# Altium schematic sheet [8] TSAL.SchDoc
size A4; DocumentNumber: 8; SheetNumber: 9; SheetTotal: 10
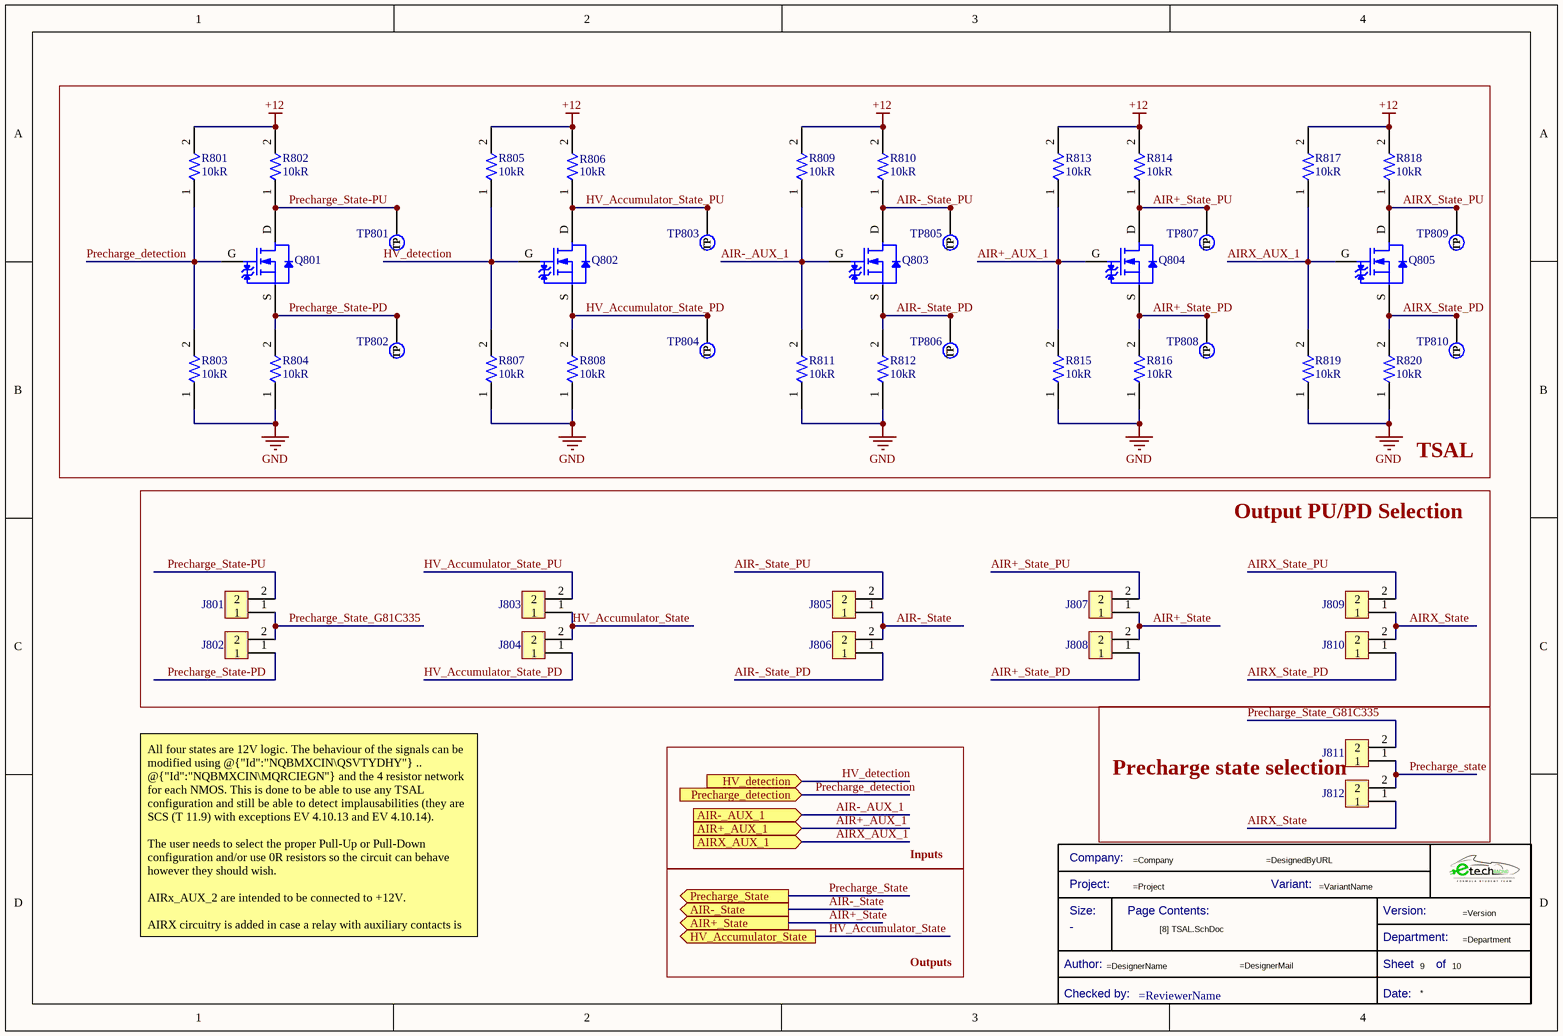
[diagram p0: [8] TSAL.SchDoc]

## Parts
*?  Title Block_template  (value not drawn)  (graphical)
J801  61300211121  [J_Pinheader_1x2]  (value not drawn)
J802  61300211121  [J_Pinheader_1x2]  (value not drawn)
J803  61300211121  [J_Pinheader_1x2]  (value not drawn)
J804  61300211121  [J_Pinheader_1x2]  (value not drawn)
J805  61300211121  [J_Pinheader_1x2]  (value not drawn)
J806  61300211121  [J_Pinheader_1x2]  (value not drawn)
J807  61300211121  [J_Pinheader_1x2]  (value not drawn)
J808  61300211121  [J_Pinheader_1x2]  (value not drawn)
J809  61300211121  [J_Pinheader_1x2]  (value not drawn)
J810  61300211121  [J_Pinheader_1x2]  (value not drawn)
J811  61300211121  [J_Pinheader_1x2]  (value not drawn)
J812  61300211121  [J_Pinheader_1x2]  (value not drawn)
Q801  CPH3455-TL-H  [TRT-NCH-3/35-CPH]  (value not drawn)
Q802  CPH3455-TL-H  [TRT-NCH-3/35-CPH]  (value not drawn)
Q803  CPH3455-TL-H  [TRT-NCH-3/35-CPH]  (value not drawn)
Q804  CPH3455-TL-H  [TRT-NCH-3/35-CPH]  (value not drawn)
Q805  CPH3455-TL-H  [TRT-NCH-3/35-CPH]  (value not drawn)
R801  Resistance: 10kR  [R0805FTK]  (hidden comment: CR0805-JW-103ELF)
R802  Resistance: 10kR  [R0805FTK]  (hidden comment: CR0805-JW-103ELF)
R803  Resistance: 10kR  [R0805FTK]  (hidden comment: CR0805-JW-103ELF)
R804  Resistance: 10kR  [R0805FTK]  (hidden comment: CR0805-JW-103ELF)
R805  Resistance: 10kR  [R0805FTK]  (hidden comment: CR0805-JW-103ELF)
R806  Resistance: 10kR  [R0805FTK]  (hidden comment: CR0805-JW-103ELF)
R807  Resistance: 10kR  [R0805FTK]  (hidden comment: CR0805-JW-103ELF)
R808  Resistance: 10kR  [R0805FTK]  (hidden comment: CR0805-JW-103ELF)
R809  Resistance: 10kR  [R0805FTK]  (hidden comment: CR0805-JW-103ELF)
R810  Resistance: 10kR  [R0805FTK]  (hidden comment: CR0805-JW-103ELF)
R811  Resistance: 10kR  [R0805FTK]  (hidden comment: CR0805-JW-103ELF)
R812  Resistance: 10kR  [R0805FTK]  (hidden comment: CR0805-JW-103ELF)
R813  Resistance: 10kR  [R0805FTK]  (hidden comment: CR0805-JW-103ELF)
R814  Resistance: 10kR  [R0805FTK]  (hidden comment: CR0805-JW-103ELF)
R815  Resistance: 10kR  [R0805FTK]  (hidden comment: CR0805-JW-103ELF)
R816  Resistance: 10kR  [R0805FTK]  (hidden comment: CR0805-JW-103ELF)
R817  Resistance: 10kR  [R0805FTK]  (hidden comment: CR0805-JW-103ELF)
R818  Resistance: 10kR  [R0805FTK]  (hidden comment: CR0805-JW-103ELF)
R819  Resistance: 10kR  [R0805FTK]  (hidden comment: CR0805-JW-103ELF)
R820  Resistance: 10kR  [R0805FTK]  (hidden comment: CR0805-JW-103ELF)
TP801  TestPoint  [TestPoint]  (value not drawn)  (no BOM)
TP802  TestPoint  [TestPoint]  (value not drawn)  (no BOM)
TP803  TestPoint  [TestPoint]  (value not drawn)  (no BOM)
TP804  TestPoint  [TestPoint]  (value not drawn)  (no BOM)
TP805  TestPoint  [TestPoint]  (value not drawn)  (no BOM)
TP806  TestPoint  [TestPoint]  (value not drawn)  (no BOM)
TP807  TestPoint  [TestPoint]  (value not drawn)  (no BOM)
TP808  TestPoint  [TestPoint]  (value not drawn)  (no BOM)
TP809  TestPoint  [TestPoint]  (value not drawn)  (no BOM)
TP810  TestPoint  [TestPoint]  (value not drawn)  (no BOM)

## Blocks framed on the sheet
TSAL: Q801-Q805 R801-R820 TP801-TP810
Output PU/PD Selection: J801-J810
Precharge state selection: J811 J812

## Ports
AIR+_AUX_1 (in), AIR+_State (out), AIR-_AUX_1 (in), AIR-_State (out), AIRX_AUX_1 (in), HV_Accumulator_State (out), HV_detection (in), Precharge_detection (in), Precharge_State (out)

## Nets
+12: R801.2 R802.2 R805.2 R806.2 R809.2 R810.2 R813.2 R814.2 R817.2 R818.2
GND: R803.1 R804.1 R807.1 R808.1 R811.1 R812.1 R815.1 R816.1 R819.1 R820.1
AIR+_AUX_1: Q804.G R813.1 R815.2 ; port AIR+_AUX_1
AIR+_State: J807.1 J808.2 ; port AIR+_State
AIR+_State_PD: J808.1 Q804.S R816.2 TP808.1(TP)
AIR+_State_PU: J807.2 Q804.D R814.1 TP807.1(TP)
AIR-_AUX_1: Q803.G R809.1 R811.2 ; port AIR-_AUX_1
AIR-_State: J805.1 J806.2 ; port AIR-_State
AIR-_State_PD: J806.1 Q803.S R812.2 TP806.1(TP)
AIR-_State_PU: J805.2 Q803.D R810.1 TP805.1(TP)
AIRX_AUX_1: Q805.G R817.1 R819.2 ; port AIRX_AUX_1
AIRX_State: J809.1 J810.2 J812.1
AIRX_State_PD: J810.1 Q805.S R820.2 TP810.1(TP)
AIRX_State_PU: J809.2 Q805.D R818.1 TP809.1(TP)
HV_Accumulator_State: J803.1 J804.2 ; port HV_Accumulator_State
HV_Accumulator_State_PD: J804.1 Q802.S R808.2 TP804.1(TP)
HV_Accumulator_State_PU: J803.2 Q802.D R806.1 TP803.1(TP)
HV_detection: Q802.G R805.1 R807.2 ; port HV_detection
Precharge_detection: Q801.G R801.1 R803.2 ; port Precharge_detection
Precharge_State: J811.1 J812.2 ; port Precharge_State
Precharge_State-PD: J802.1 Q801.S R804.2 TP802.1(TP)
Precharge_State-PU: J801.2 Q801.D R802.1 TP801.1(TP)
Precharge_State_G81C335: J801.1 J802.2 J811.2

## Notes on the sheet
- Inputs
- All four states are 12V logic. The behaviour of the signals can be modified using @{"Id":"NQBMXCIN\QSVTYDHY"} .. @{"Id":"NQBMXCIN\MQRCIEGN"} and the 4 resistor network for each NMOS. This is done to be able to use any TSAL configuration and still be able to detect implausabilities (they are SCS (T 11.9) with exceptions EV 4.10.13 and EV 4.10.14).
  The user needs to select the proper Pull-Up or Pull-Down configuration and/or use 0R resistors so the circuit can behave however they should wish.
  AIRx_AUX_2 are intended to be connected to +12V.
  AIRX circuitry is added in case a relay with auxiliary contacts is added as the precharge relay.
- Outputs
- (in symbol Title Block_template) Company:; Project:; Variant:; Size:; Page Contents:; Version:; Department:; Author:; Sheet; of; Checked by:; Date:

## Library data of the parts
*? = Title Block_template: Standard Title Block; Category: Title Block; Checked by:: =ReviewerName; Size: -
J801-J812 = J_Jumper: CONN HEADER 2 POS 2.54; Manufacturer: Molex; Temperature rating: -40° to +105°C; Category type: PCB-PCB; Product name: Pin Header; Maximum current: 3 A; Maximum voltage: 250 V AC; Connections: 1x2; Current Rating: 3A; Voltage Rating: 250V; Number of Positions: 2; Gender: Male; Connector Type: Male Pin; Pitch: 0.1inch; .Creator: GP; Category: Connector; ComponentLink1Description: Datasheet; ComponentLink1URL: https://www.we-online.com/catalog/datasheet/61300211121.pdf; ComponentLink2Description: Where buy it; ComponentLink2URL: https://www.we-online.com/catalog/en/PHD_2_54_THT_PIN_HEADER_6130XX11121?sq=61300211121&sp=https%3A%2F%2Fwww.we-online.com%2Fweb%2Fen%2Fwuerth_elektronik%2Fsearchpage.php%3Fsearch%3D61300211121#61300211121; Manufacturer part number: 61300211121; Supplier: Würth Elektronik; RoHS: *; Application: Shortcircuit; Flammability: 94V-0; Orientation: Vertical; Mount: Through hole; Supplier 1: RSComponents; Stock 1: 1855; Pricing 1: 5=0,14100, 50=0,09700, 100=0,07800, 200=0,07300, 500=0,06800 (USD); Contact Plating: Gold; Housing Material: PBT; Contact Material: Copper Alloy,Copper; Color: Black; Min Operating Temperature: -40°C; Max Operating Temperature: 125°C; Number of Rows: 1; Contact Gender: Male; Packaging: Bulk; Termination: Through Hole; Number of Contacts: 2; Contact Mating Length: 0.236inch; REACH SVHC: Unknown; Lead Free: Lead Free; ComponentLink3URL: https://datasheet.ciiva.com/13619/6130xx11121-48870-13619345.pdf?src-supplier=Mouser; ComponentLink3Description: https://datasheet.ciiva.com/13619/6130xx11121-48870-13619345.pdf?src-supplier=Mouser; Supplier Part Number 1: 8281581
Q801-Q805 = TRT-NCH-3/35-CPH: CPH3455-TL-H N-channel MOSFET Transistor; 3 A; 35 V; 3-Pin CPH; Manufacturer: ON Semiconductor; Rds On Max: 104mR; Input Capacitance: 186pF; Rise Time: 4.7ns; Drain to Source Voltage (Vdss): 35V; Continuous Drain Current (ID): 3A; Max Power Dissipation: 1W; Drain to Source Resistance: 108mR; Turn-On Delay Time: 4.2ns; Turn-Off Delay Time: 15ns; Fall Time: 5.7ns; Element Configuration: Single; Gate to Source Voltage (Vgs): 20V; .Creator: GP; Category: Transistor; ComponentLink1Description: Datasheet; ComponentLink1URL: https://docs.rs-online.com/5847/0900766b812d514d.pdf; ComponentLink2Description: Where buy it; ComponentLink2URL: https://es.rs-online.com/web/p/mosfet/8009989; Supplier 1: RSComponents; Manufacturer Part Number: CPH3455-TL-H; RoHS: Yes; Stock 1: 1; Pricing 1: 50=0,50400 (USD); Case/Package: SC; Number of Pins: 3; Min Operating Temperature: -55°C; Max Operating Temperature: 150°C; Package Quantity: 3000; Packaging: Tape and Reel; Drain to Source Breakdown Voltage: 35V; Power Dissipation: 1W; Polarity: N-CHANNEL; Series: -; Length: 2.9mm; Width: 1.6mm; Height: 0.9mm; Lead Free: Lead Free; Halogen Free: Halogen Free; RoHS Compliant: Yes; ComponentLink3URL: https://datasheet.ciiva.com/947/cph3455-d-947201.pdf?src-supplier=Digi-Key; ComponentLink3Description: https://datasheet.ciiva.com/947/cph3455-d-947201.pdf?src-supplier=Digi-Key; ComponentLink4URL: https://datasheet.ciiva.com/4444/cph3455-d-91653-4444616.pdf?src-supplier=Mouser; ComponentLink4Description: https://datasheet.ciiva.com/4444/cph3455-d-91653-4444616.pdf?src-supplier=Mouser; ComponentLink5URL: https://datasheet.ciiva.com/11164/cph3455-d-11164889.pdf?src-supplier=Avnet; ComponentLink5Description: https://datasheet.ciiva.com/11164/cph3455-d-11164889.pdf?src-supplier=Avnet; Supplier Part Number 1: 8009989
R801-R820 = R10k-0805FTK: BOURNS         CR0805-JW-103ELF            Surface Mount Chip Resistor, Thick Film, CR Series, 10 kohm, 125 mW,  5%, 150 V; Temperature Coefficient: 200ppm/°C; Power Rating: 125mW; Voltage Rating: 150V; Voltage Rating (DC): 100V; .Creator: DR; Supplier 1: Arrow Electronics; Manufacturer 1: Bourns; Manufacturer Part Number 1: CR0805-JW-103ELF; RoHS: Yes; Category: Chip SMD Resistors; Stock 1: 57566; Pricing 1: 1=0,05790, 10=0,01540, 25=0,01340, 100=0,00340 (USD); Mount: Surface Mount; Case/Package: 0805; Number of Pins: 2; Contact Plating: Tin; Case Code (Metric): 2012; Case Code (Imperial): 0805; Min Operating Temperature: -55°C; Max Operating Temperature: 155°C; Tolerance: 5%; Resistor Type: Thick Film; Package Quantity: 1; Packaging: Tape and Reel; Number of Terminations: 2; Termination: SMD/SMT; Max Power Dissipation: 125mW; Features: Moisture Resistant; Series: CR0805; Construction: Rectangular; Resistance Tolerance: 5%; Technology: THICK FILM; Length: 2mm; Width: 1.25mm; Height: 0.5mm; Depth: 1.25mm; Thickness: 508um; Radiation Hardening: No; REACH SVHC: No SVHC; Military Standard: Not; RoHS Compliant: Yes; ComponentLink1URL: https://datasheet.ciiva.com/11821/0900766b80fcdb72-11821135.pdf?src-supplier=RSComponents; ComponentLink1Description: https://datasheet.ciiva.com/11821/0900766b80fcdb72-11821135.pdf?src-supplier=RSComponents; ComponentLink2URL: https://datasheet.ciiva.com/9122/chpreztr-9122374.pdf?src-supplier=Avnet; ComponentLink2Description: https://datasheet.ciiva.com/9122/chpreztr-9122374.pdf?src-supplier=Avnet; ComponentLink3URL: https://datasheet.ciiva.com/22693/1902866-22693254.pdf?src-supplier=Element14; ComponentLink3Description: https://datasheet.ciiva.com/22693/1902866-22693254.pdf?src-supplier=Element14; ComponentLink4URL: https://datasheet.ciiva.com/7986/691949-7986187.pdf?src-supplier=Element14; ComponentLink4Description: https://datasheet.ciiva.com/7986/691949-7986187.pdf?src-supplier=Element14; ComponentLink5URL: https://datasheet.ciiva.com/30065/159chpreztr-30065976.pdf?src-supplier=Onlinecomponents.com; ComponentLink5Description: https://datasheet.ciiva.com/30065/159chpreztr-30065976.pdf?src-supplier=Onlinecomponents.com; ComponentLink6URL: https://datasheet.ciiva.com/16783/70154685-16783482.pdf?src-supplier=Allied+Electronics; ComponentLink6Description: https://datasheet.ciiva.com/16783/70154685-16783482.pdf?src-supplier=Allied+Electronics; ComponentLink7URL: https://datasheet.ciiva.com/5548/chpreztr-5548491.pdf?src-supplier=Mouser; ComponentLink7Description: https://datasheet.ciiva.com/5548/chpreztr-5548491.pdf?src-supplier=Mouser; ComponentLink8URL: https://datasheet.ciiva.com/6559/chpreztr-6559900.pdf?src-supplier=Digi-Key; ComponentLink8Description: https://datasheet.ciiva.com/6559/chpreztr-6559900.pdf?src-supplier=Digi-Key; ComponentLink9URL: https://datasheet.ciiva.com/6559/chpreztr-6559901.pdf?src-supplier=Digi-Key; ComponentLink9Description: https://datasheet.ciiva.com/6559/chpreztr-6559901.pdf?src-supplier=Digi-Key; ComponentLink10URL: https://datasheet.ciiva.com/7985/1856384-7985869.pdf?src-supplier=Element14; ComponentLink10Description: https://datasheet.ciiva.com/7985/1856384-7985869.pdf?src-supplier=Element14; ComponentLink11URL: https://datasheet.ciiva.com/48692/001055517-da-01-en-smd-wid-cr0805-jw-103elf-10k-ohm-1-8w-48692118.pdf?src-supplier=Conrad; ComponentLink11Description: https://datasheet.ciiva.com/48692/001055517-da-01-en-smd-wid-cr0805-jw-103elf-10k-ohm-1-8w-48692118.pdf?src-supplier=Conrad; Supplier Part Number 1: CR0805-JW-103ELF
TP801-TP810 = TestPoint: Test Point 1x1 mm; .Creator: GP; Category: TestPoint; .PCBcheck: GP; .SCHcheck: GP